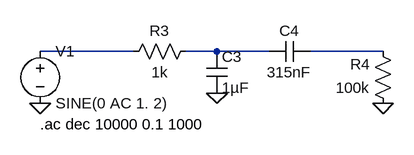
[diagram p0: schematic bandpass filter.asc]
bandpass filter.asc, the LTspice schematic file:
Version 4
SHEET 1 1124 680
WIRE -128 -544 -272 -544
WIRE 0 -544 -48 -544
WIRE 80 -544 0 -544
WIRE 256 -544 144 -544
FLAG -272 -464 0
FLAG 0 -480 0
FLAG 256 -464 0
SYMBOL voltage -272 -560 R0
WINDOW 123 0 0 Left 0
WINDOW 39 0 0 Left 0
SYMATTR InstName V1
SYMATTR Value SINE(0 AC 1. 2)
SYMBOL res -32 -560 R90
WINDOW 0 0 56 VBottom 2
WINDOW 3 32 56 VTop 2
SYMATTR InstName R3
SYMATTR Value 1k
SYMBOL cap -16 -544 R0
SYMATTR InstName C3
SYMATTR Value 1µF
SYMBOL res 272 -448 R180
WINDOW 0 36 76 Left 2
WINDOW 3 36 40 Left 2
SYMATTR InstName R4
SYMATTR Value 100k
SYMBOL cap 80 -528 R270
WINDOW 0 32 32 VTop 2
WINDOW 3 0 32 VBottom 2
SYMATTR InstName C4
SYMATTR Value 315nF
TEXT -272 -432 Left 2 !.ac dec 10000 0.1 1000

The netlist it stands for:
* bandpass filter.asc
V1 N001 0 SINE(0 AC 1. 2)
R3 N002 N001 1k
C3 N002 0 1µF
R4 0 N003 100k
C4 N002 N003 315nF
.ac dec 10000 0.1 1000
.backanno
.end